# Altium schematic sheet 401_GridPos4.SchDoc
size A2; Organization: Greenfield Tech Solutions; Address1: Molendreef 33; Address2: Ossendrecht; Address3: 4641CS; Address4: The Netherlands; SheetNumber: 4; SheetTotal: 7
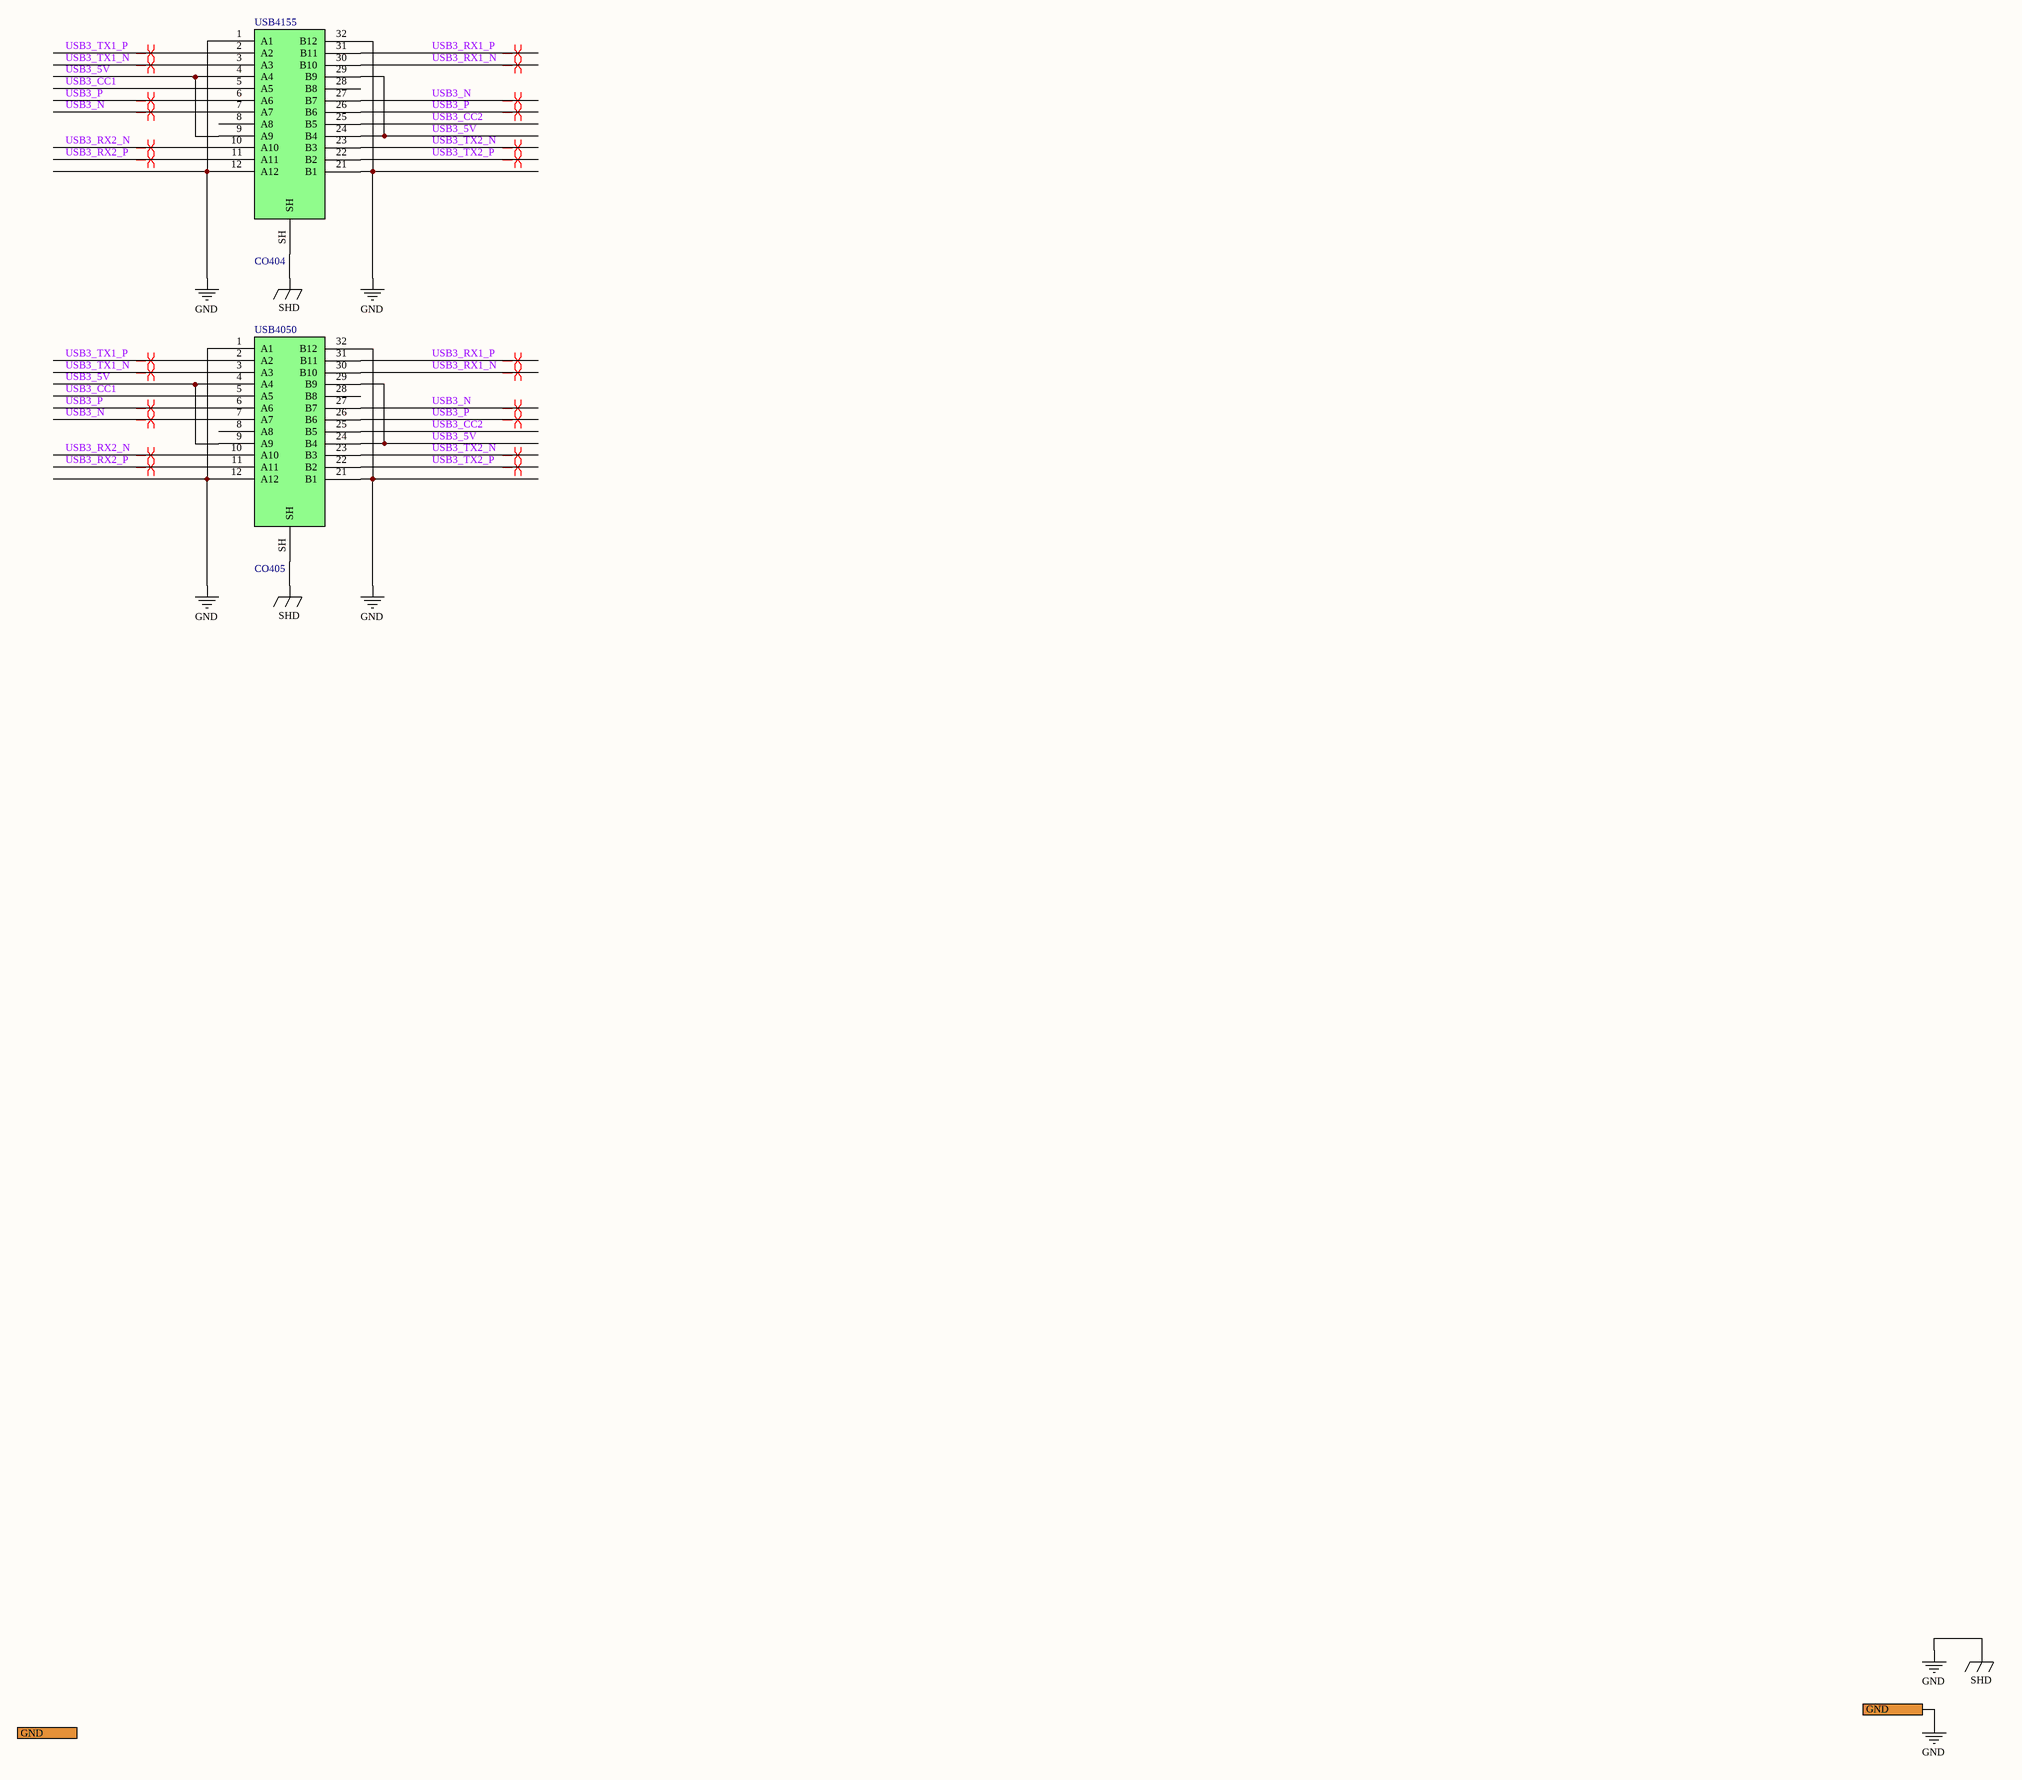
[diagram p0: 401_GridPos4.SchDoc]

## Parts
CO404  USB4155  [USB4155-03-C]
CO405  USB4050  [USB4050-30-A]

## Ports
GND

## Nets
GND: CO404.1(A1) CO404.12(A12) CO404.21(B1) CO404.32(B12) CO404.SH CO405.1(A1) CO405.12(A12) CO405.21(B1) CO405.32(B12) CO405.SH ; port GND  [also labelled SHD]
USB3_5V: CO404.4(A4) CO404.9(A9) CO404.24(B4) CO404.29(B9) CO405.4(A4) CO405.9(A9) CO405.24(B4) CO405.29(B9)
USB3_CC1: CO404.5(A5) CO405.5(A5)
USB3_CC2: CO404.25(B5) CO405.25(B5)
USB3_N: CO404.7(A7) CO404.27(B7) CO405.7(A7) CO405.27(B7)
USB3_P: CO404.6(A6) CO404.26(B6) CO405.6(A6) CO405.26(B6)
USB3_RX1_N: CO404.30(B10) CO405.30(B10)
USB3_RX1_P: CO404.31(B11) CO405.31(B11)
USB3_RX2_N: CO404.10(A10) CO405.10(A10)
USB3_RX2_P: CO404.11(A11) CO405.11(A11)
USB3_TX1_N: CO404.3(A3) CO405.3(A3)
USB3_TX1_P: CO404.2(A2) CO405.2(A2)
USB3_TX2_N: CO404.23(B3) CO405.23(B3)
USB3_TX2_P: CO404.22(B2) CO405.22(B2)

Not connected (* = marked no-connect by the designer): CO404 8(A8) 28(B8); CO405 8(A8) 28(B8)

## Layout directives
differential pair; differential pair class USB3: USB3_N, USB3_P, USB3_RX1_N, USB3_RX1_P, USB3_RX2_N, USB3_RX2_P, USB3_TX1_N, USB3_TX1_P, USB3_TX2_N, USB3_TX2_P

## Notes on the sheet
- Title
- Size:
- Date:
- File:
- A2
- Number:
- Time:
- Revision:
- Sheet
- of

## Library data of the parts
CO404 = CO0031: USB C connector Plug Horizontal; Part Number: CO0031; ID: 30; RefVal: USB4155; ManfactPart: USB4155-03-C
CO405 = CO0039: USB C connector Receptacle Horizontal; Part Number: CO0039; ID: 39; RefVal: USB4050; ManfactPart: USB4050-30-A